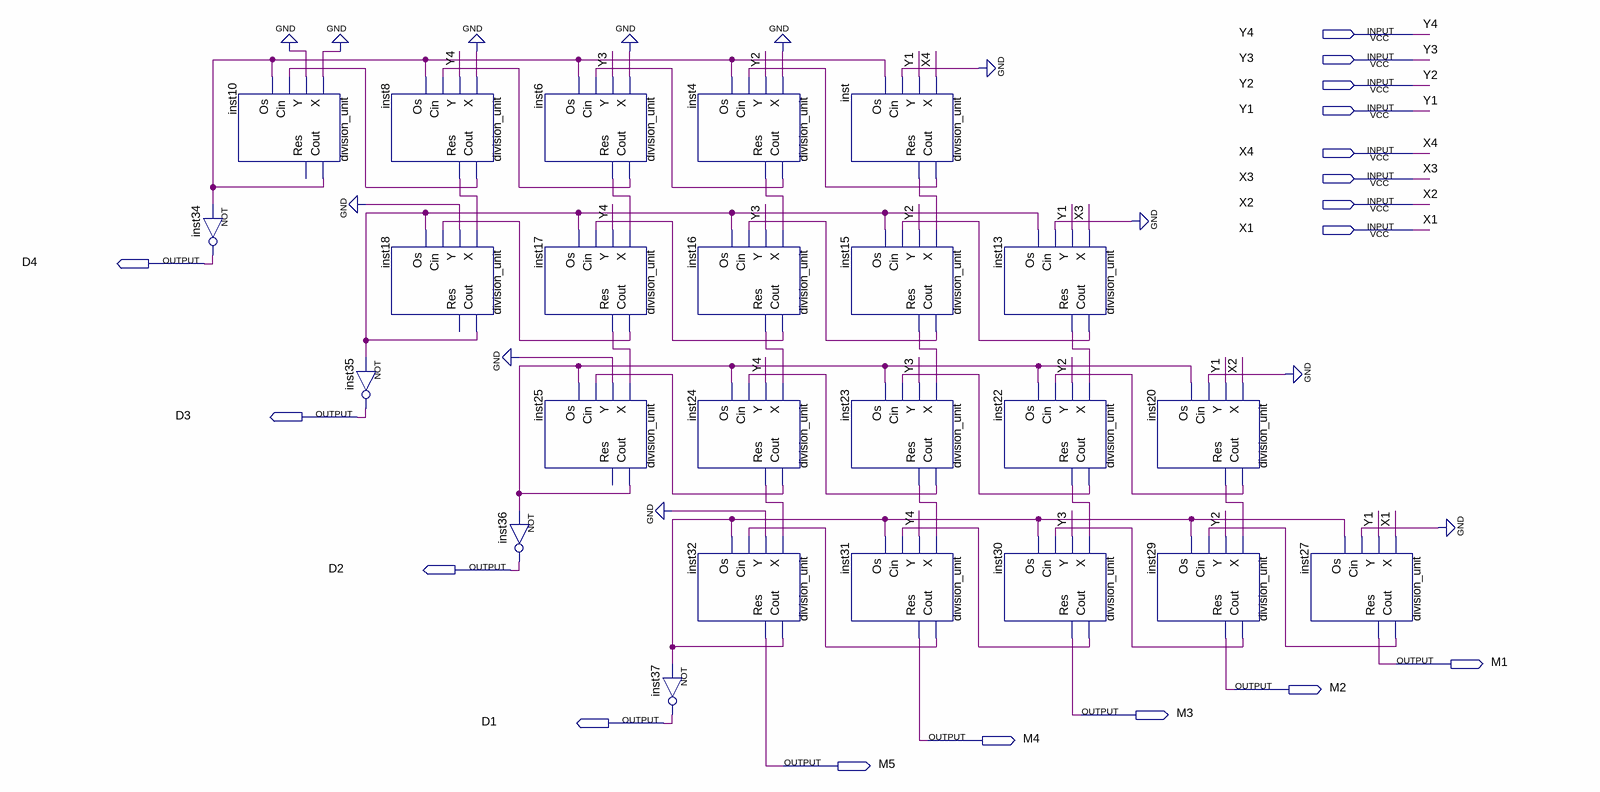
[diagram p0: schematic sheet]
// Quartus schematic project12.bdf as structural Verilog: 24 symbols, 17 pins
module project12 (
  input  Y4,
  input  Y3,
  input  Y2,
  input  Y1,
  input  X4,
  input  X3,
  input  X2,
  input  X1,
  output D4,
  output D3,
  output D2,
  output M1,
  output M2,
  output M3,
  output D1,
  output M4,
  output M5
);

  wire inst4_cout, inst4_res, inst6_cout, inst6_res, inst8_cout, inst8_res, inst10_cout, inst13_cout,
       inst13_res, inst15_cout, inst15_res, inst16_cout, inst16_res, inst17_cout, inst17_res, inst18_cout,
       inst20_cout, inst20_res, inst22_cout, inst22_res, inst23_cout, inst23_res, inst24_cout, inst24_res,
       inst25_cout, inst27_cout, inst29_cout, inst30_cout, inst31_cout, inst32_cout, inst_cout, inst_res;

  not inst34 (D4, inst10_cout);
  division_unit inst10 (.X(1'b0), .Y(1'b0), .Cin(inst8_cout), .Os(inst10_cout), .Cout(inst10_cout));  // open: Res
  not inst35 (D3, inst18_cout);
  division_unit inst8 (.X(1'b0), .Y(Y4), .Cin(inst6_cout), .Os(inst10_cout), .Cout(inst8_cout), .Res(inst8_res));
  division_unit inst18 (.X(inst8_res), .Y(1'b0), .Cin(inst17_cout), .Os(inst18_cout), .Cout(inst18_cout));  // open: Res
  division_unit inst6 (.X(1'b0), .Y(Y3), .Cin(inst4_cout), .Os(inst10_cout), .Cout(inst6_cout), .Res(inst6_res));
  division_unit inst17 (
    .X(inst6_res), .Y(Y4), .Cin(inst16_cout), .Os(inst18_cout), .Cout(inst17_cout), .Res(inst17_res));
  division_unit inst25 (
    .X(inst17_res), .Y(1'b0), .Cin(inst24_cout), .Os(inst25_cout), .Cout(inst25_cout));  // open: Res
  not inst36 (D2, inst25_cout);
  division_unit inst4 (.X(1'b0), .Y(Y2), .Cin(inst_cout), .Os(inst10_cout), .Cout(inst4_cout), .Res(inst4_res));
  division_unit inst16 (
    .X(inst4_res), .Y(Y3), .Cin(inst15_cout), .Os(inst18_cout), .Cout(inst16_cout), .Res(inst16_res));
  division_unit inst24 (
    .X(inst16_res), .Y(Y4), .Cin(inst23_cout), .Os(inst25_cout), .Cout(inst24_cout), .Res(inst24_res));
  division_unit inst32 (.X(inst24_res), .Y(1'b0), .Cin(inst31_cout), .Os(inst32_cout), .Cout(inst32_cout), .Res(M5));
  not inst37 (D1, inst32_cout);
  division_unit inst (.X(X4), .Y(Y1), .Cin(1'b0), .Os(inst10_cout), .Cout(inst_cout), .Res(inst_res));
  division_unit inst15 (
    .X(inst_res), .Y(Y2), .Cin(inst13_cout), .Os(inst18_cout), .Cout(inst15_cout), .Res(inst15_res));
  division_unit inst23 (
    .X(inst15_res), .Y(Y3), .Cin(inst22_cout), .Os(inst25_cout), .Cout(inst23_cout), .Res(inst23_res));
  division_unit inst31 (.X(inst23_res), .Y(Y4), .Cin(inst30_cout), .Os(inst32_cout), .Cout(inst31_cout), .Res(M4));
  division_unit inst13 (.X(X3), .Y(Y1), .Cin(1'b0), .Os(inst18_cout), .Cout(inst13_cout), .Res(inst13_res));
  division_unit inst22 (
    .X(inst13_res), .Y(Y2), .Cin(inst20_cout), .Os(inst25_cout), .Cout(inst22_cout), .Res(inst22_res));
  division_unit inst30 (.X(inst22_res), .Y(Y3), .Cin(inst29_cout), .Os(inst32_cout), .Cout(inst30_cout), .Res(M3));
  division_unit inst20 (.X(X2), .Y(Y1), .Cin(1'b0), .Os(inst25_cout), .Cout(inst20_cout), .Res(inst20_res));
  division_unit inst29 (.X(inst20_res), .Y(Y2), .Cin(inst27_cout), .Os(inst32_cout), .Cout(inst29_cout), .Res(M2));
  division_unit inst27 (.X(X1), .Y(Y1), .Cin(1'b0), .Os(inst32_cout), .Cout(inst27_cout), .Res(M1));
endmodule
